# Altium schematic sheet Sheet_STM32F103C8.SchDoc
size A4
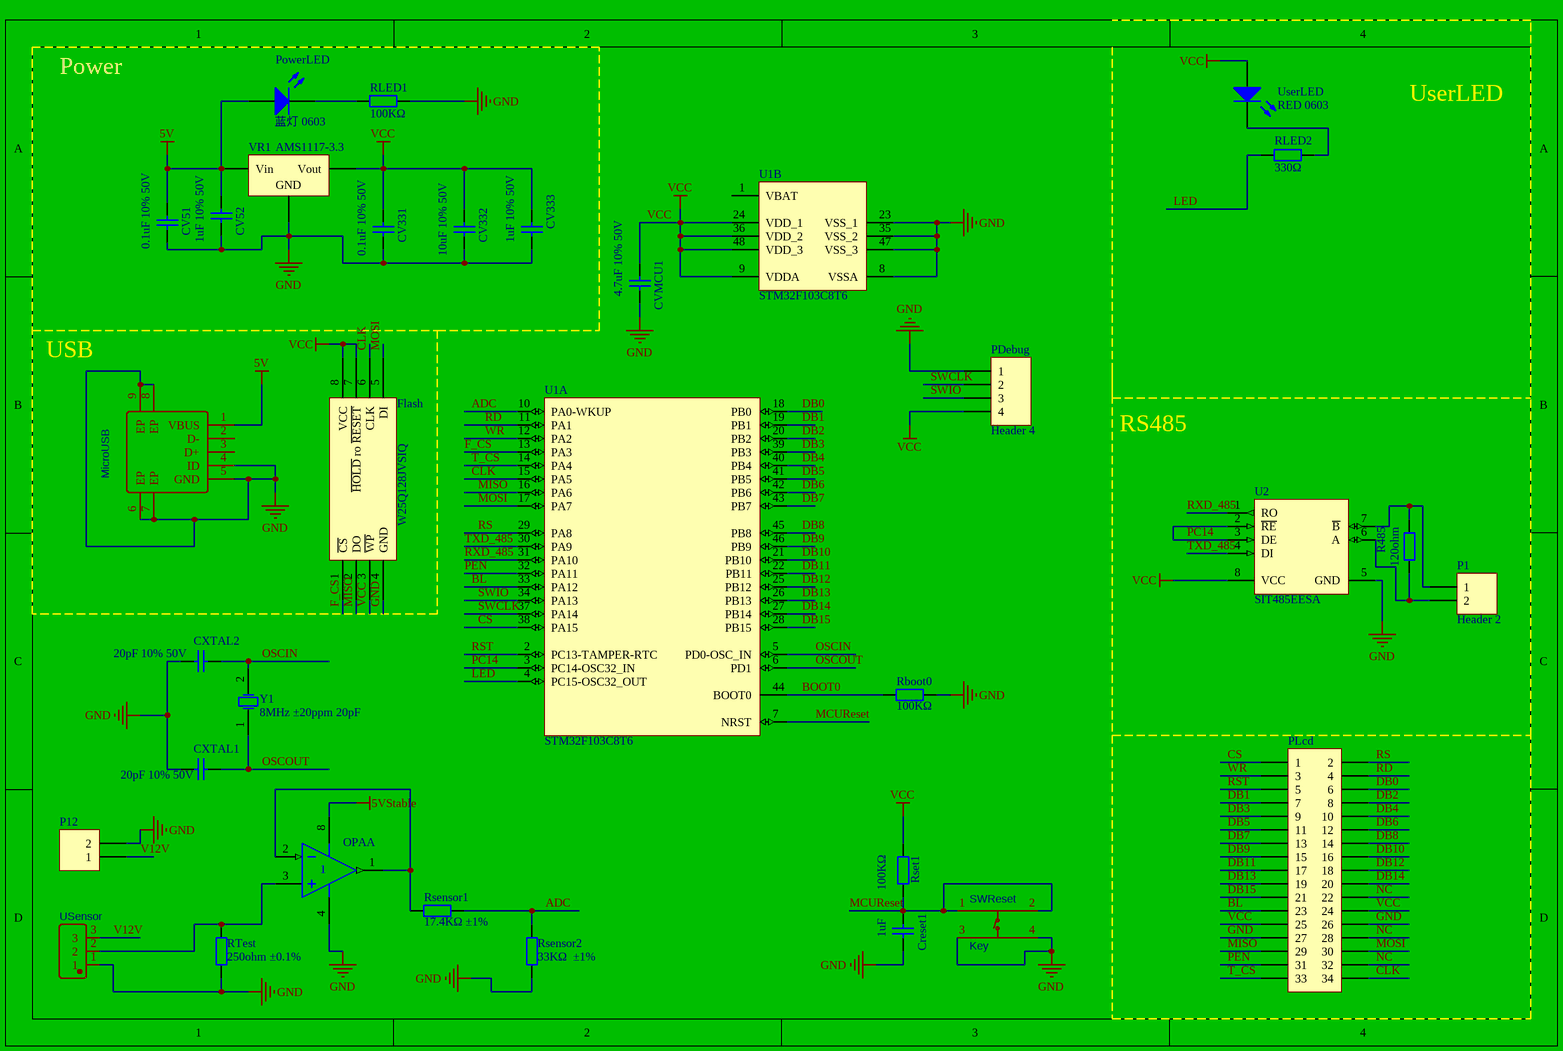
[diagram p0: Sheet_STM32F103C8.SchDoc]

## Parts
Creset1  1uF  [1206_C]
CV51  0.1uF 10% 50V  [0805_C]
CV52  1uF 10% 50V  [0805_C]
CV331  0.1uF 10% 50V  [0805_C]
CV332  10uF 10% 50V  [0805_C]
CV333  1uF 10% 50V  [0805_C]
CVMCU1  4.7uF 10% 50V  [0805_C]
CXTAL1  20pF 10% 50V  [0805_C]
CXTAL2  20pF 10% 50V  [0805_C]
Flash  W25Q128JVSIQ  [SOIC-8_208mil]
MicroUSB  U254-051N-4BH806  [MICRO-USB-SMD_U254-051N-4BH806]  (value not drawn)
OPA  LM358DR2G  [SOIC-8_150mil]  (value not drawn)  (part A of 2)
P1  Header 2  [HDR1X2]
P12  Header 2  [HDR1X2]  (value not drawn)
PDebug  Header 4  [HDR1X4]
PLcd  LCD  [HDR2X17]  (value not drawn)
PowerLED  蓝灯 0603  [0603_LED_S1]
R485  120ohm  [0805_R]
Rboot0  100KΩ  [1206_R]
RLED1  100KΩ  [0805_R]
RLED2  330Ω  [0805_R]
Rsensor1  17.4KΩ ±1%  [1206_R]
Rsensor2  33KΩ  ±1%  [1206_R]
Rset1  100KΩ  [1206_R]
RTest  250ohm ±0.1%  [12Z-2010]
SWReset  Key  [SW-TH_4P-L6.0-W6.0-P4.50-LS6.5]
U1  STM32F103C8T6  [LQFP-48_7x7x05P]  (parts A,B of 2)
U2  SIT485EESA  [SOIC-8_150mil]
USensor  KF396-3.96-3P  [CONN-TH_3P-P3.96_KF396-3.96-3P]  (value not drawn)
UserLED  RED 0603  [0603_LED_S1]
VR1  AMS1117-3.3  [SOT-223]
Y1  8MHz ±20ppm 20pF  [SMD-5032_2P]

## Blocks framed on the sheet
USB: Flash MicroUSB

## Nets
5V: CV51.2 CV52.2 MicroUSB.1(VBUS) PowerLED.A VR1.3(Vin)
5VStable: OPA.8(V+)
GND: Creset1.1 CV51.1 CV52.1 CV331.1 CV332.1 CV333.1 CVMCU1.1 CXTAL1.1 CXTAL2.1 Flash.4(GND) MicroUSB.4(ID) MicroUSB.5(GND) MicroUSB.6(EP) MicroUSB.7(EP) MicroUSB.8(EP) MicroUSB.9(EP) OPA.4(V-) P12.2 PDebug.1 PLcd.26 PLcd.27 Rboot0.2 RLED1.2 Rsensor2.1 RTest.1 SWReset.3(C) SWReset.4(D) U1.8(VSSA) U1.23(VSS_1) U1.35(VSS_2) U1.47(VSS_3) U2.5(GND) USensor.1 VR1.1(GND)
VCC: CV331.2 CV332.2 CV333.2 CVMCU1.2 Flash.3(~{WP}) Flash.7(~{HOLD}_ro_~{RESET}) Flash.8(VCC) PDebug.4 PLcd.24 PLcd.25 Rset1.2 U1.9(VDDA) U1.24(VDD_1) U1.36(VDD_2) U1.48(VDD_3) U2.8(VCC) UserLED.A VR1.2(Vout)
ADC: Rsensor1.2 Rsensor2.2 U1.10(PA0-WKUP)
BL: PLcd.23 U1.33(PA12)
BOOT0: Rboot0.1 U1.44(BOOT0)
CLK: Flash.6(CLK) PLcd.34 U1.15(PA5)
CS: PLcd.1 U1.38(PA15)
DB0: PLcd.6 U1.18(PB0)
DB1: PLcd.7 U1.19(PB1)
DB2: PLcd.8 U1.20(PB2)
DB3: PLcd.9 U1.39(PB3)
DB4: PLcd.10 U1.40(PB4)
DB5: PLcd.11 U1.41(PB5)
DB6: PLcd.12 U1.42(PB6)
DB7: PLcd.13 U1.43(PB7)
DB8: PLcd.14 U1.45(PB8)
DB9: PLcd.15 U1.46(PB9)
DB10: PLcd.16 U1.21(PB10)
DB11: PLcd.17 U1.22(PB11)
DB12: PLcd.18 U1.25(PB12)
DB13: PLcd.19 U1.26(PB13)
DB14: PLcd.20 U1.27(PB14)
DB15: PLcd.21 U1.28(PB15)
F_CS: Flash.1(~{CS}) U1.13(PA3)
LED: RLED2.1 U1.4(PC15-OSC32_OUT)
MCUReset: Creset1.2 Rset1.1 SWReset.1(A) SWReset.2(B) U1.7(NRST)
MISO: Flash.2(DO) PLcd.29 U1.16(PA6)
MOSI: Flash.5(DI) PLcd.30 U1.17(PA7)
NC: PLcd.22 PLcd.28 PLcd.32
OSCIN: CXTAL2.2 U1.5(PD0-OSC_IN) Y1.2(OSC2)
OSCOUT: CXTAL1.2 U1.6(PD1) Y1.1(OSC1)
PC14: U1.3(PC14-OSC32_IN) U2.2(~{RE}) U2.3(DE)
PEN: PLcd.31 U1.32(PA11)
RD: PLcd.4 U1.11(PA1)
RS: PLcd.2 U1.29(PA8)
RST: PLcd.5 U1.2(PC13-TAMPER-RTC)
RXD_485: U1.31(PA10) U2.1(RO)
SWCLK: PDebug.2 U1.37(PA14)
SWIO: PDebug.3 U1.34(PA13)
T_CS: PLcd.33 U1.14(PA4)
TXD_485: U1.30(PA9) U2.4(DI)
V12V: P12.1 USensor.3
WR: PLcd.3 U1.12(PA2)
NetOPA_1: OPA.1(OUT) OPA.2(IN-) Rsensor1.1
NetOPA_3: OPA.3(IN+) RTest.2 USensor.2
NetP1_1: P1.1 R485.2 U2.7(~{B})
NetP1_2: P1.2 R485.1 U2.6(A)
NetPowerLED_K: PowerLED.K RLED1.1
NetRLED2_2: RLED2.2 UserLED.K

Not connected (* = marked no-connect by the designer): MicroUSB 2(D-) 3(D+); U1 1(VBAT)

## Notes on the sheet
- Power
- UserLED
- RS485

## Library data of the parts
Creset1 = 1206 1nF (102) 10% 500V: 贴片电容; ComponentLink1Description: 供应商链接; ComponentLink1URL: http://www.szlcsc.com/product/details_36187.html; Package: 1206; Supplier: LC; SuppliersPartNumber: C35216
CV51 CV52 CV331-CV333 CVMCU1 = 0805 4.7uF (475) 10% 25V: 贴片电容; ComponentLink1Description: 供应商链接; ComponentLink1URL: http://www.szlcsc.com/product/details_2131.html; Package: 0805; Supplier: LC; SuppliersPartNumber: C1779
CXTAL1 CXTAL2 = 0805 1uF (105) 10% 50V: 贴片电容; ComponentLink1Description: 供应商链接; ComponentLink1URL: http://www.szlcsc.com/product/details_29074.html; Package: 0805; Supplier: LC; SuppliersPartNumber: C28323
Flash = W25Q128FVSIGTR_[C110643]: Flash ROM; ComponentLink1Description: 供应商链接; ComponentLink1URL: http://www.szlcsc.com/product/details_111868.html; Package: SOIC-8; Supplier: LC; SuppliersPartNumber: C113767
MicroUSB = U254-051N-4BH806: microUSB; BOM_Manufacturer: XKB Enterprise; Contributor: LCSC; BOM_Supplier: LCSC; BOM_Supplier Part: C319170; BOM_Manufacturer Part: U254-051N-4BH806; spicePre: U; spiceSymbolName: U254-051N-4BH806
OPA = LM358DR2G_[C7950]: 通用运放; ComponentLink1Description: 供应商链接; ComponentLink1URL: http://www.szlcsc.com/product/details_8427.html; Package: SOIC-8; Supplier: LC; SuppliersPartNumber: C7950
P1 P12 = Header 2: Header, 2-Pin; LatestRevisionDate: 17-Jul-2002; LatestRevisionNote: Re-released for DXP Platform.; Publisher: Altium Limited
PDebug = Header 4: Header, 4-Pin; LatestRevisionDate: 17-Jul-2002; LatestRevisionNote: Re-released for DXP Platform.; Publisher: Altium Limited
PLcd = Header 17X2: Header, 17-Pin, Dual row; LatestRevisionDate: 17-Jul-2002; LatestRevisionNote: Re-released for DXP Platform.; Publisher: Altium Limited
PowerLED UserLED = 0603 蓝灯: 发光二极管; ComponentLink1Description: 供应商链接; ComponentLink1URL: http://www.szlcsc.com/product/details_73150.html; Package: 0603; Supplier: LC; SuppliersPartNumber: C72041
R485 = 0805 3KΩ (3001) 1%: 贴片电阻; ComponentLink1Description: 供应商链接; ComponentLink1URL: http://www.szlcsc.com/product/details_18349.html; Package: 0805; Supplier: LC; SuppliersPartNumber: C17661
Rboot0 Rsensor1 Rsensor2 Rset1 = 1206 1KΩ (1001) 1%: 贴片电阻; ComponentLink1Description: 供应商链接; ComponentLink1URL: http://www.szlcsc.com/product/details_4817.html; Package: 1206; Supplier: LC; SuppliersPartNumber: C4410
RLED1 RLED2 = 0805 2KΩ (2001) 1%: 贴片电阻; ComponentLink1Description: 供应商链接; ComponentLink1URL: http://www.szlcsc.com/product/details_18292.html; Package: 0805; Supplier: LC; SuppliersPartNumber: C17604
RTest = 0402 0Ω (0R0) 1%: 贴片电阻; ComponentLink1Description: 供应商链接; ComponentLink1URL: http://www.szlcsc.com/product/details_17853.html; Package: 0402; Supplier: LC; SuppliersPartNumber: C17168
SWReset = Key: BOM_Manufacturer: SHOU HAN; BOM_Manufacturer Part: TS665CJ; Contributor: LCSC; BOM_Supplier: LCSC; BOM_Supplier Part: C393938; spicePre: S; spiceSymbolName: TS665CJ
U1 = STM32F103C8T6: ARM; ComponentLink1Description: 供应商链接; ComponentLink1URL: http://www.szlcsc.com/product/details_9243.html; Package: LQFP-48_7x7x05P; Supplier: LC; SuppliersPartNumber: C8734
U2 = SP485EEN-L/TR_[C6855]: RS-485/RS-422; ComponentLink1Description: 供应商链接; ComponentLink1URL: http://www.szlcsc.com/product/details_7327.html; Package: SOIC-8; Supplier: LC; SuppliersPartNumber: C6855
USensor = KF396-3.96-3P: BOM_Manufacturer: Cixi Kefa Elec; Contributor: LCSC; BOM_Supplier: LCSC; BOM_Supplier Part: C474895; BOM_Manufacturer Part: KF396-3.96-3P; spicePre: U; spiceSymbolName: KF396-3.96-3P
VR1 = SOT-223 AMS1117-3.3: 低压差线性稳压(LDO); ComponentLink1Description: 供应商链接; ComponentLink1URL: http://www.szlcsc.com/product/details_6652.html; Package: SOT-223; Supplier: LC; SuppliersPartNumber: C6186
Y1 = SMD-5032_2P 8MHz 20ppm 20pF: 贴片晶振; ComponentLink1Description: 供应商链接; ComponentLink1URL: http://www.szlcsc.com/product/details_117214.html; Package: SMD-5032_2P; Supplier: LC; SuppliersPartNumber: C115962